# Altium schematic sheet HIVE_BOARD_TOP.SchDoc
size Tabloid; SheetNumber: 3; SheetTotal: 12; Sheet_Name: Top; Size: 11x17
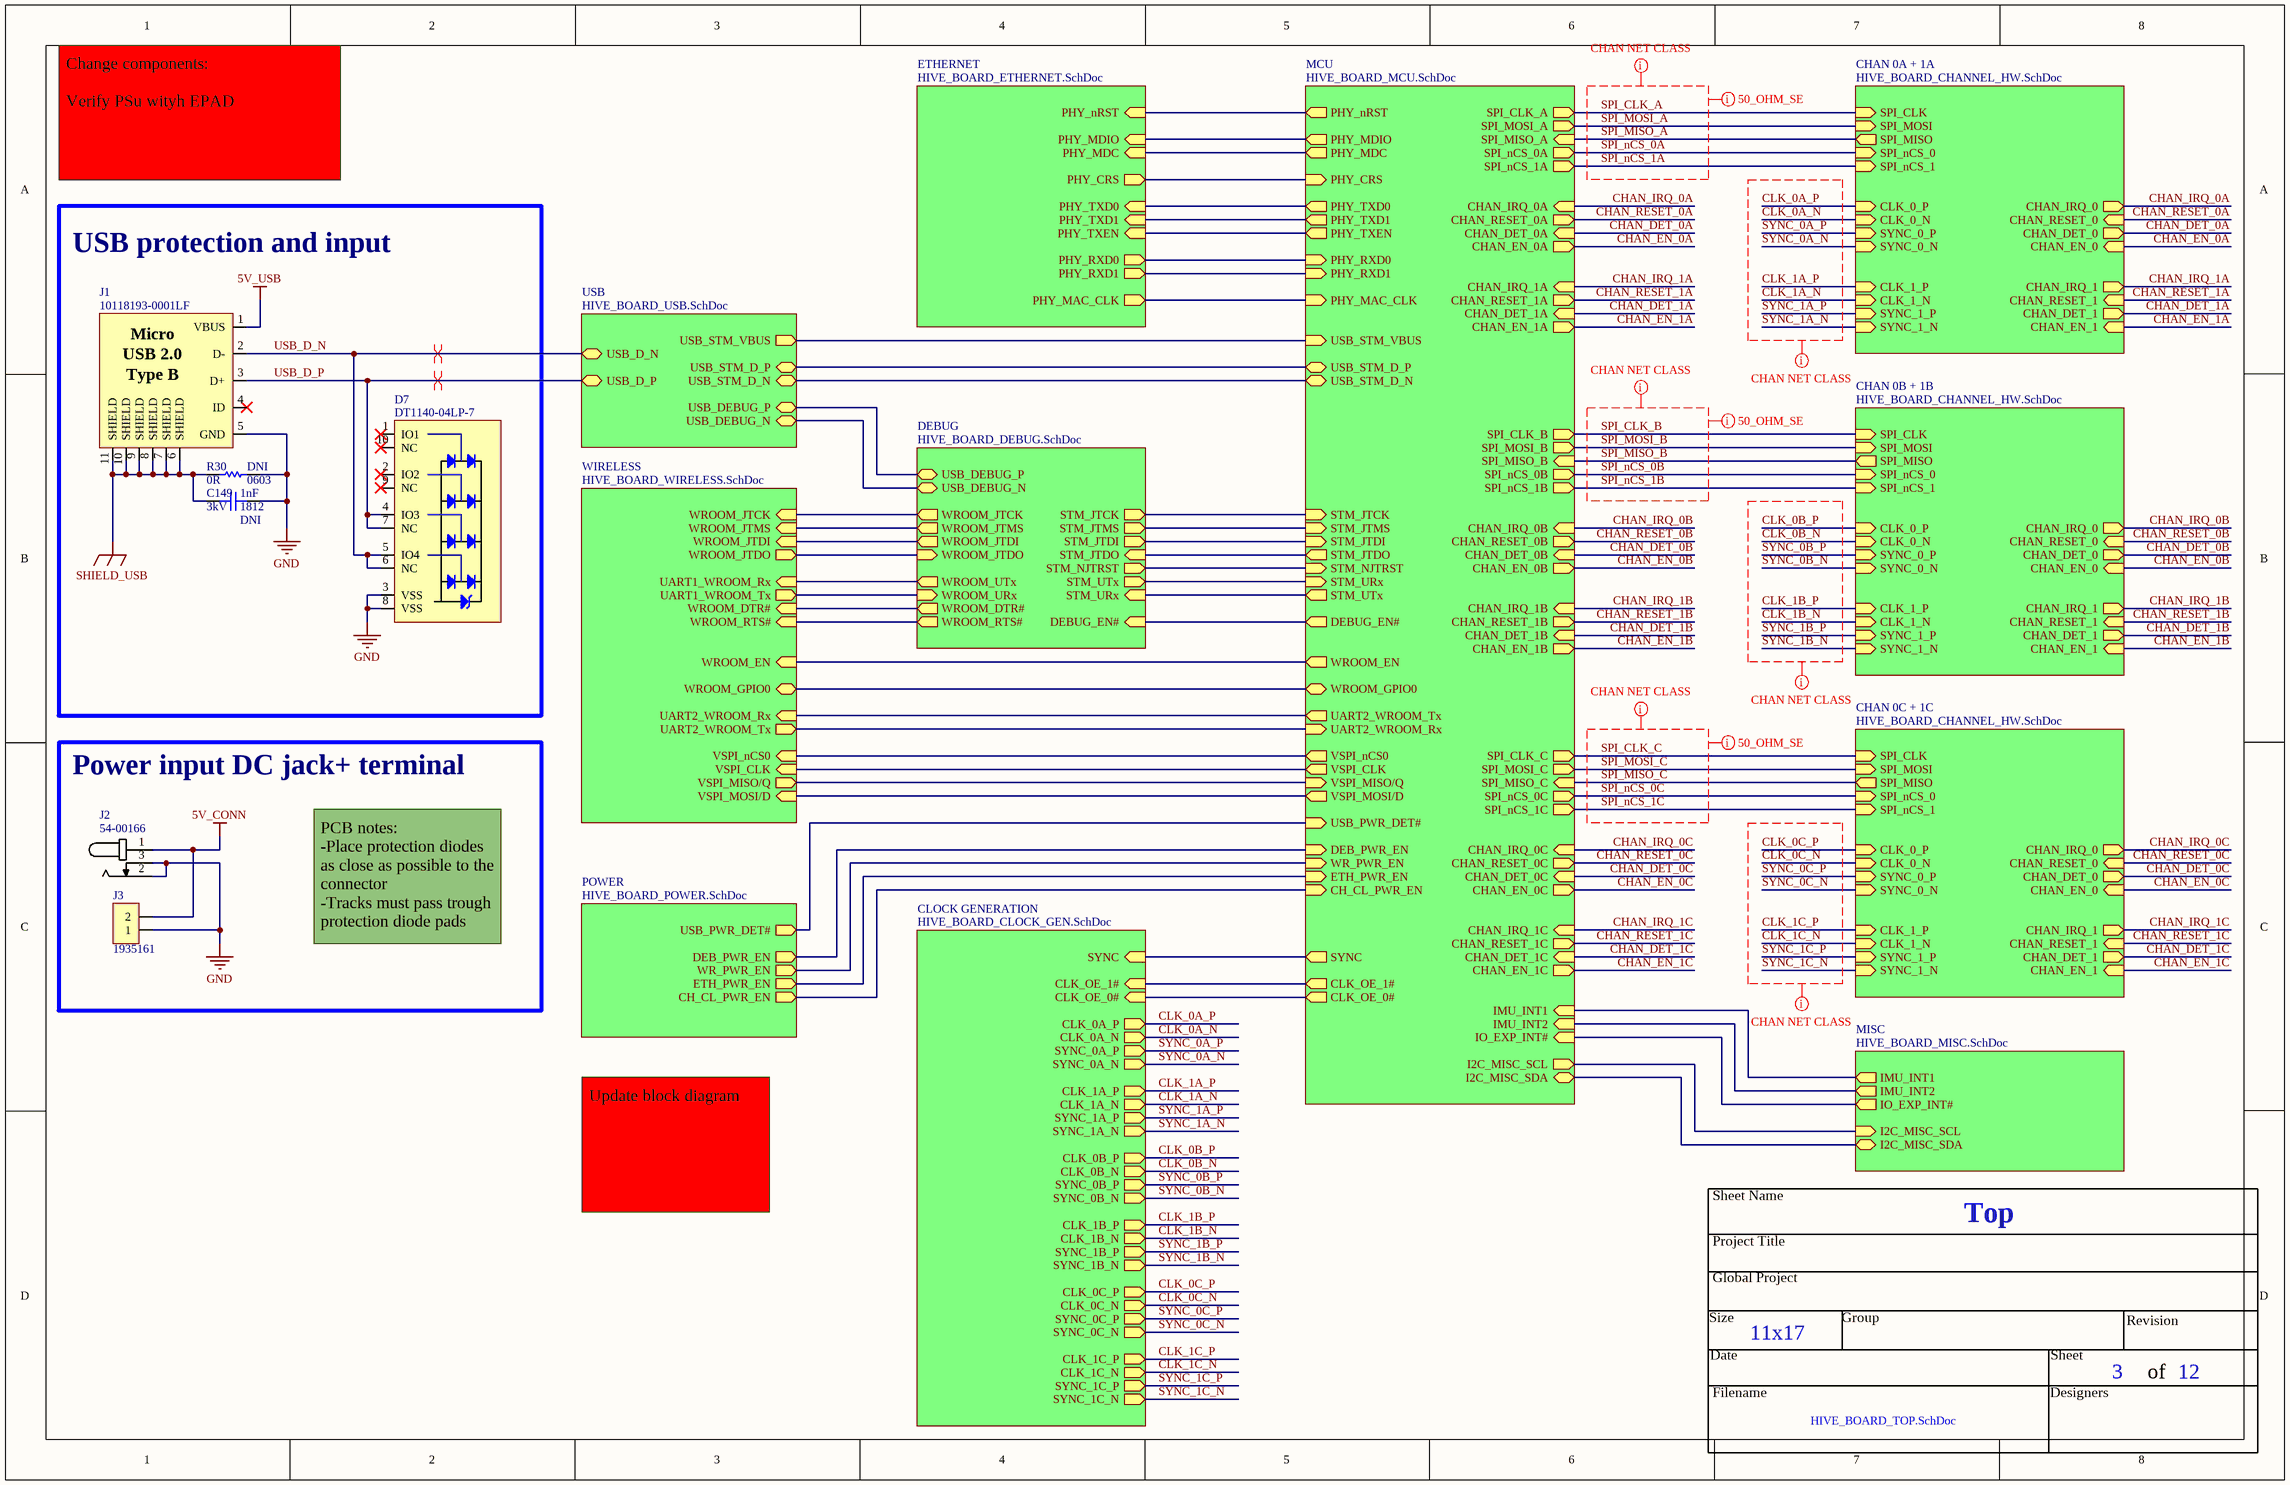
[diagram p0: HIVE_BOARD_TOP.SchDoc]

## Parts
C149  value 1nF  Package: 1812  Voltage Rating: 3kV  Assembly Note: DNI  [CAP_CER_1812]  (hidden comment: 885342211009)
D7  DT1140-04LP-7  [TVS_DATA_DT1140-04LP-7]
J1  10118193-0001LF  [CON_USB_10118194-0001LF]
J2  54-00166  [CON_PWR_PJ-002A]
J3  1935161  [CON_ 1935161]
R30  value 0R  Assembly Note: DNI  Package: 0603  [RES_0603]  (hidden comment: RC0603JR-070RL)

## Blocks framed on the sheet
USB protection and input: C149 D7 J1 R30
Power input DC jack+ terminal: J2 J3

## Sub-sheets
CHAN 0A + 1A = HIVE_BOARD_CHANNEL_HW.SchDoc: SPI_MISO (out), SPI_MOSI (in), SPI_CLK (in), SPI_nCS_1 (in), SPI_nCS_0 (in), SYNC_1_P (in), CLK_1_N (in), SYNC_1_N (in), CLK_1_P (in), SYNC_0_P (in), CLK_0_P (in), CLK_0_N (in), SYNC_0_N (in), CHAN_EN_0 (in), CHAN_DET_0 (out), CHAN_IRQ_0 (out), CHAN_RESET_0 (in), CHAN_EN_1 (in), CHAN_IRQ_1 (out), CHAN_RESET_1 (in), CHAN_DET_1 (out)
CHAN 0B + 1B = HIVE_BOARD_CHANNEL_HW.SchDoc: SPI_MISO (out), SPI_MOSI (in), SPI_CLK (in), SPI_nCS_1 (in), SPI_nCS_0 (in), SYNC_1_P (in), CLK_1_N (in), SYNC_1_N (in), CLK_1_P (in), SYNC_0_P (in), CLK_0_P (in), CLK_0_N (in), SYNC_0_N (in), CHAN_EN_0 (in), CHAN_DET_0 (out), CHAN_IRQ_0 (out), CHAN_RESET_0 (in), CHAN_EN_1 (in), CHAN_IRQ_1 (out), CHAN_RESET_1 (in), CHAN_DET_1 (out)
CHAN 0C + 1C = HIVE_BOARD_CHANNEL_HW.SchDoc: SPI_MISO (out), SPI_MOSI (in), SPI_CLK (in), SPI_nCS_1 (in), SPI_nCS_0 (in), SYNC_1_P (in), CLK_1_N (in), SYNC_1_N (in), CLK_1_P (in), SYNC_0_P (in), CLK_0_P (in), CLK_0_N (in), SYNC_0_N (in), CHAN_EN_0 (in), CHAN_DET_0 (out), CHAN_IRQ_0 (out), CHAN_RESET_0 (in), CHAN_EN_1 (in), CHAN_IRQ_1 (out), CHAN_RESET_1 (in), CHAN_DET_1 (out)
CLOCK GENERATION = HIVE_BOARD_CLOCK_GEN.SchDoc: SYNC (in), SYNC_0B_P (out), SYNC_0A_N (out), SYNC_1C_N (out), SYNC_1B_N (out), SYNC_1C_P (out), CLK_1B_P (out), CLK_0C_P (out), SYNC_0C_N (out), CLK_1A_N (out), CLK_1B_N (out), CLK_1A_P (out), SYNC_1A_N (out), CLK_0B_P (out), SYNC_1B_P (out), SYNC_0C_P (out), CLK_0B_N (out), CLK_1C_N (out), SYNC_0B_N (out), CLK_1C_P (out), SYNC_1A_P (out), CLK_0C_N (out), SYNC_0A_P (out), CLK_0A_P (out), CLK_0A_N (out), CLK_OE_1# (in), CLK_OE_0# (in)
DEBUG = HIVE_BOARD_DEBUG.SchDoc: WROOM_JTCK (out), WROOM_JTDO (in), WROOM_UTx (out), WROOM_JTMS (out), WROOM_URx (in), WROOM_JTDI (out), WROOM_RTS# (out), WROOM_DTR# (out), STM_URx (in), STM_JTDI (out), STM_JTCK (out), STM_JTDO (in), STM_JTMS (out), STM_UTx (out), STM_NJTRST (out), USB_DEBUG_P (bidir), USB_DEBUG_N (bidir), DEBUG_EN# (in)
ETHERNET = HIVE_BOARD_ETHERNET.SchDoc: PHY_nRST (in), PHY_CRS (out), PHY_RXD0 (out), PHY_TXD1 (in), PHY_RXD1 (out), PHY_MDC (in), PHY_MDIO (in), PHY_TXEN (in), PHY_TXD0 (in), PHY_MAC_CLK (out)
MCU = HIVE_BOARD_MCU.SchDoc: SYNC (out), SPI_nCS_1A (out), SPI_MOSI_A (out), SPI_nCS_0A (out), SPI_CLK_A (out), SPI_MISO_A (in), USB_PWR_DET# (in), CHAN_EN_0A (out), CHAN_DET_0A (in), CHAN_IRQ_0A (in), CHAN_RESET_0A (out), CHAN_EN_1A (out), CHAN_IRQ_1A (in), CHAN_RESET_1A (out), CHAN_DET_1A (in), SPI_MOSI_B (out), SPI_CLK_B (out), SPI_MISO_B (in), SPI_nCS_0B (out), SPI_nCS_1B (out), SPI_MOSI_C (out), SPI_CLK_C (out), SPI_MISO_C (in), SPI_nCS_1C (out), SPI_nCS_0C (out), CHAN_DET_0C (in), CHAN_IRQ_0C (in), CHAN_EN_0C (out), CHAN_RESET_0C (out), CHAN_IRQ_1C (in), CHAN_RESET_1C (out), CHAN_EN_1C (out), CHAN_DET_1C (in), CHAN_DET_1B (in), CHAN_EN_1B (out), CHAN_RESET_1B (out), CHAN_IRQ_1B (in), CHAN_IRQ_0B (in), CHAN_EN_0B (out), CHAN_RESET_0B (out), CHAN_DET_0B (in), IMU_INT2 (in), PHY_RXD1 (in), PHY_TXD0 (out), PHY_nRST (out), PHY_MAC_CLK (in), PHY_MDIO (out), PHY_TXD1 (out), PHY_TXEN (out), PHY_MDC (out), PHY_RXD0 (in), PHY_CRS (in), CLK_OE_1# (out), CLK_OE_0# (out), USB_STM_VBUS (in), USB_STM_D_P (bidir), USB_STM_D_N (bidir), WROOM_EN (out), WROOM_GPIO0 (bidir), UART2_WROOM_Tx (out), UART2_WROOM_Rx (in), VSPI_nCS0 (out), VSPI_CLK (out), VSPI_MISO/Q (in), VSPI_MOSI/D (out), STM_UTx (out), STM_URx (in), STM_JTDO (out), STM_JTCK (in), STM_NJTRST (in), STM_JTDI (in), STM_JTMS (in), DEBUG_EN# (out), CH_CL_PWR_EN (in), ETH_PWR_EN (in), WR_PWR_EN (in), DEB_PWR_EN (in), IO_EXP_INT# (in), I2C_MISC_SCL (out), I2C_MISC_SDA (bidir), IMU_INT1 (in)
MISC = HIVE_BOARD_MISC.SchDoc: IMU_INT2 (out), I2C_MISC_SCL (in), I2C_MISC_SDA (bidir), IO_EXP_INT# (out), IMU_INT1 (out)
POWER = HIVE_BOARD_POWER.SchDoc: USB_PWR_DET# (out), WR_PWR_EN (out), CH_CL_PWR_EN (out), ETH_PWR_EN (out), DEB_PWR_EN (out)
USB = HIVE_BOARD_USB.SchDoc: USB_DEBUG_P (bidir), USB_DEBUG_N (bidir), USB_D_N (bidir), USB_D_P (bidir), USB_STM_D_N (bidir), USB_STM_D_P (bidir), USB_STM_VBUS (out)
WIRELESS = HIVE_BOARD_WIRELESS.SchDoc: WROOM_JTDI (in), WROOM_JTCK (in), WROOM_JTMS (in), WROOM_JTDO (out), WROOM_RTS# (in), WROOM_DTR# (in), UART1_WROOM_Rx (in), UART1_WROOM_Tx (out), VSPI_CLK (in), WROOM_EN (in), VSPI_nCS0 (in), UART2_WROOM_Rx (in), UART2_WROOM_Tx (out), WROOM_GPIO0 (bidir), VSPI_MISO/Q (out), VSPI_MOSI/D (in)

## Nets
5V_CONN: J2.1 J3.2
5V_USB: J1.1(VBUS)
GND: C149.1 D7.3(VSS) D7.8(VSS) J1.5(GND) J2.2 J2.3 J3.1 R30.1
SHIELD_USB: C149.2 J1.6(SHIELD) J1.7(SHIELD) J1.8(SHIELD) J1.9(SHIELD) J1.10(SHIELD) J1.11(SHIELD) R30.2
CHAN_DET_0A: sheet MCU/CHAN_DET_0A, sheet CHAN 0A + 1A/CHAN_DET_0
CHAN_DET_0B: sheet MCU/CHAN_DET_0B, sheet CHAN 0B + 1B/CHAN_DET_0
CHAN_DET_0C: sheet MCU/CHAN_DET_0C, sheet CHAN 0C + 1C/CHAN_DET_0
CHAN_DET_1A: sheet MCU/CHAN_DET_1A, sheet CHAN 0A + 1A/CHAN_DET_1
CHAN_DET_1B: sheet MCU/CHAN_DET_1B, sheet CHAN 0B + 1B/CHAN_DET_1
CHAN_DET_1C: sheet MCU/CHAN_DET_1C, sheet CHAN 0C + 1C/CHAN_DET_1
CHAN_EN_0A: sheet MCU/CHAN_EN_0A, sheet CHAN 0A + 1A/CHAN_EN_0
CHAN_EN_0B: sheet MCU/CHAN_EN_0B, sheet CHAN 0B + 1B/CHAN_EN_0
CHAN_EN_0C: sheet MCU/CHAN_EN_0C, sheet CHAN 0C + 1C/CHAN_EN_0
CHAN_EN_1A: sheet MCU/CHAN_EN_1A, sheet CHAN 0A + 1A/CHAN_EN_1
CHAN_EN_1B: sheet MCU/CHAN_EN_1B, sheet CHAN 0B + 1B/CHAN_EN_1
CHAN_EN_1C: sheet MCU/CHAN_EN_1C, sheet CHAN 0C + 1C/CHAN_EN_1
CHAN_IRQ_0A: sheet MCU/CHAN_IRQ_0A, sheet CHAN 0A + 1A/CHAN_IRQ_0
CHAN_IRQ_0B: sheet MCU/CHAN_IRQ_0B, sheet CHAN 0B + 1B/CHAN_IRQ_0
CHAN_IRQ_0C: sheet MCU/CHAN_IRQ_0C, sheet CHAN 0C + 1C/CHAN_IRQ_0
CHAN_IRQ_1A: sheet MCU/CHAN_IRQ_1A, sheet CHAN 0A + 1A/CHAN_IRQ_1
CHAN_IRQ_1B: sheet MCU/CHAN_IRQ_1B, sheet CHAN 0B + 1B/CHAN_IRQ_1
CHAN_IRQ_1C: sheet MCU/CHAN_IRQ_1C, sheet CHAN 0C + 1C/CHAN_IRQ_1
CHAN_RESET_0A: sheet MCU/CHAN_RESET_0A, sheet CHAN 0A + 1A/CHAN_RESET_0
CHAN_RESET_0B: sheet MCU/CHAN_RESET_0B, sheet CHAN 0B + 1B/CHAN_RESET_0
CHAN_RESET_0C: sheet MCU/CHAN_RESET_0C, sheet CHAN 0C + 1C/CHAN_RESET_0
CHAN_RESET_1A: sheet MCU/CHAN_RESET_1A, sheet CHAN 0A + 1A/CHAN_RESET_1
CHAN_RESET_1B: sheet MCU/CHAN_RESET_1B, sheet CHAN 0B + 1B/CHAN_RESET_1
CHAN_RESET_1C: sheet MCU/CHAN_RESET_1C, sheet CHAN 0C + 1C/CHAN_RESET_1
CLK_0A_N: sheet CLOCK GENERATION/CLK_0A_N, sheet CHAN 0A + 1A/CLK_0_N
CLK_0A_P: sheet CLOCK GENERATION/CLK_0A_P, sheet CHAN 0A + 1A/CLK_0_P
CLK_0B_N: sheet CLOCK GENERATION/CLK_0B_N, sheet CHAN 0B + 1B/CLK_0_N
CLK_0B_P: sheet CLOCK GENERATION/CLK_0B_P, sheet CHAN 0B + 1B/CLK_0_P
CLK_0C_N: sheet CLOCK GENERATION/CLK_0C_N, sheet CHAN 0C + 1C/CLK_0_N
CLK_0C_P: sheet CLOCK GENERATION/CLK_0C_P, sheet CHAN 0C + 1C/CLK_0_P
CLK_1A_N: sheet CLOCK GENERATION/CLK_1A_N, sheet CHAN 0A + 1A/CLK_1_N
CLK_1A_P: sheet CLOCK GENERATION/CLK_1A_P, sheet CHAN 0A + 1A/CLK_1_P
CLK_1B_N: sheet CLOCK GENERATION/CLK_1B_N, sheet CHAN 0B + 1B/CLK_1_N
CLK_1B_P: sheet CLOCK GENERATION/CLK_1B_P, sheet CHAN 0B + 1B/CLK_1_P
CLK_1C_N: sheet CLOCK GENERATION/CLK_1C_N, sheet CHAN 0C + 1C/CLK_1_N
CLK_1C_P: sheet CLOCK GENERATION/CLK_1C_P, sheet CHAN 0C + 1C/CLK_1_P
SPI_CLK_A: sheet MCU/SPI_CLK_A, sheet CHAN 0A + 1A/SPI_CLK
SPI_CLK_B: sheet MCU/SPI_CLK_B, sheet CHAN 0B + 1B/SPI_CLK
SPI_CLK_C: sheet MCU/SPI_CLK_C, sheet CHAN 0C + 1C/SPI_CLK
SPI_MISO_A: sheet MCU/SPI_MISO_A, sheet CHAN 0A + 1A/SPI_MISO
SPI_MISO_B: sheet MCU/SPI_MISO_B, sheet CHAN 0B + 1B/SPI_MISO
SPI_MISO_C: sheet MCU/SPI_MISO_C, sheet CHAN 0C + 1C/SPI_MISO
SPI_MOSI_A: sheet MCU/SPI_MOSI_A, sheet CHAN 0A + 1A/SPI_MOSI
SPI_MOSI_B: sheet MCU/SPI_MOSI_B, sheet CHAN 0B + 1B/SPI_MOSI
SPI_MOSI_C: sheet MCU/SPI_MOSI_C, sheet CHAN 0C + 1C/SPI_MOSI
SPI_nCS_0A: sheet MCU/SPI_nCS_0A, sheet CHAN 0A + 1A/SPI_nCS_0
SPI_nCS_0B: sheet MCU/SPI_nCS_0B, sheet CHAN 0B + 1B/SPI_nCS_0
SPI_nCS_0C: sheet MCU/SPI_nCS_0C, sheet CHAN 0C + 1C/SPI_nCS_0
SPI_nCS_1A: sheet MCU/SPI_nCS_1A, sheet CHAN 0A + 1A/SPI_nCS_1
SPI_nCS_1B: sheet MCU/SPI_nCS_1B, sheet CHAN 0B + 1B/SPI_nCS_1
SPI_nCS_1C: sheet MCU/SPI_nCS_1C, sheet CHAN 0C + 1C/SPI_nCS_1
SYNC_0A_N: sheet CLOCK GENERATION/SYNC_0A_N, sheet CHAN 0A + 1A/SYNC_0_N
SYNC_0A_P: sheet CLOCK GENERATION/SYNC_0A_P, sheet CHAN 0A + 1A/SYNC_0_P
SYNC_0B_N: sheet CLOCK GENERATION/SYNC_0B_N, sheet CHAN 0B + 1B/SYNC_0_N
SYNC_0B_P: sheet CLOCK GENERATION/SYNC_0B_P, sheet CHAN 0B + 1B/SYNC_0_P
SYNC_0C_N: sheet CLOCK GENERATION/SYNC_0C_N, sheet CHAN 0C + 1C/SYNC_0_N
SYNC_0C_P: sheet CLOCK GENERATION/SYNC_0C_P, sheet CHAN 0C + 1C/SYNC_0_P
SYNC_1A_N: sheet CLOCK GENERATION/SYNC_1A_N, sheet CHAN 0A + 1A/SYNC_1_N
SYNC_1A_P: sheet CLOCK GENERATION/SYNC_1A_P, sheet CHAN 0A + 1A/SYNC_1_P
SYNC_1B_N: sheet CLOCK GENERATION/SYNC_1B_N, sheet CHAN 0B + 1B/SYNC_1_N
SYNC_1B_P: sheet CLOCK GENERATION/SYNC_1B_P, sheet CHAN 0B + 1B/SYNC_1_P
SYNC_1C_N: sheet CLOCK GENERATION/SYNC_1C_N, sheet CHAN 0C + 1C/SYNC_1_N
SYNC_1C_P: sheet CLOCK GENERATION/SYNC_1C_P, sheet CHAN 0C + 1C/SYNC_1_P
USB_D_N: D7.5(IO4) D7.6(NC) J1.2(D-) ; sheet USB/USB_D_N
USB_D_P: D7.4(IO3) D7.7(NC) J1.3(D+) ; sheet USB/USB_D_P
(unnamed): sheet MCU/SYNC, sheet CLOCK GENERATION/SYNC
(unnamed): sheet MCU/USB_PWR_DET#, sheet POWER/USB_PWR_DET#
(unnamed): sheet MCU/IMU_INT2, sheet MISC/IMU_INT2
(unnamed): sheet MCU/PHY_RXD1, sheet ETHERNET/PHY_RXD1
(unnamed): sheet MCU/PHY_TXD0, sheet ETHERNET/PHY_TXD0
(unnamed): sheet MCU/PHY_nRST, sheet ETHERNET/PHY_nRST
(unnamed): sheet MCU/PHY_MAC_CLK, sheet ETHERNET/PHY_MAC_CLK
(unnamed): sheet MCU/PHY_MDIO, sheet ETHERNET/PHY_MDIO
(unnamed): sheet MCU/PHY_TXD1, sheet ETHERNET/PHY_TXD1
(unnamed): sheet MCU/PHY_TXEN, sheet ETHERNET/PHY_TXEN
(unnamed): sheet MCU/PHY_MDC, sheet ETHERNET/PHY_MDC
(unnamed): sheet MCU/PHY_RXD0, sheet ETHERNET/PHY_RXD0
(unnamed): sheet MCU/PHY_CRS, sheet ETHERNET/PHY_CRS
(unnamed): sheet MCU/CLK_OE_1#, sheet CLOCK GENERATION/CLK_OE_1#
(unnamed): sheet MCU/CLK_OE_0#, sheet CLOCK GENERATION/CLK_OE_0#
(unnamed): sheet MCU/USB_STM_VBUS, sheet USB/USB_STM_VBUS
(unnamed): sheet MCU/USB_STM_D_P, sheet USB/USB_STM_D_P
(unnamed): sheet MCU/USB_STM_D_N, sheet USB/USB_STM_D_N
(unnamed): sheet MCU/WROOM_EN, sheet WIRELESS/WROOM_EN
(unnamed): sheet MCU/WROOM_GPIO0, sheet WIRELESS/WROOM_GPIO0
(unnamed): sheet MCU/UART2_WROOM_Tx, sheet WIRELESS/UART2_WROOM_Rx
(unnamed): sheet MCU/UART2_WROOM_Rx, sheet WIRELESS/UART2_WROOM_Tx
(unnamed): sheet MCU/VSPI_nCS0, sheet WIRELESS/VSPI_nCS0
(unnamed): sheet MCU/VSPI_CLK, sheet WIRELESS/VSPI_CLK
(unnamed): sheet MCU/VSPI_MISO/Q, sheet WIRELESS/VSPI_MISO/Q
(unnamed): sheet MCU/VSPI_MOSI/D, sheet WIRELESS/VSPI_MOSI/D
(unnamed): sheet MCU/STM_UTx, sheet DEBUG/STM_URx
(unnamed): sheet MCU/STM_URx, sheet DEBUG/STM_UTx
(unnamed): sheet MCU/STM_JTDO, sheet DEBUG/STM_JTDO
(unnamed): sheet MCU/STM_JTCK, sheet DEBUG/STM_JTCK
(unnamed): sheet MCU/STM_NJTRST, sheet DEBUG/STM_NJTRST
(unnamed): sheet MCU/STM_JTDI, sheet DEBUG/STM_JTDI
(unnamed): sheet MCU/STM_JTMS, sheet DEBUG/STM_JTMS
(unnamed): sheet MCU/DEBUG_EN#, sheet DEBUG/DEBUG_EN#
(unnamed): sheet MCU/CH_CL_PWR_EN, sheet POWER/CH_CL_PWR_EN
(unnamed): sheet MCU/ETH_PWR_EN, sheet POWER/ETH_PWR_EN
(unnamed): sheet MCU/WR_PWR_EN, sheet POWER/WR_PWR_EN
(unnamed): sheet MCU/DEB_PWR_EN, sheet POWER/DEB_PWR_EN
(unnamed): sheet MCU/IO_EXP_INT#, sheet MISC/IO_EXP_INT#
(unnamed): sheet MCU/I2C_MISC_SCL, sheet MISC/I2C_MISC_SCL
(unnamed): sheet MCU/I2C_MISC_SDA, sheet MISC/I2C_MISC_SDA
(unnamed): sheet MCU/IMU_INT1, sheet MISC/IMU_INT1
(unnamed): sheet WIRELESS/WROOM_JTDI, sheet DEBUG/WROOM_JTDI
(unnamed): sheet WIRELESS/WROOM_JTCK, sheet DEBUG/WROOM_JTCK
(unnamed): sheet WIRELESS/WROOM_JTMS, sheet DEBUG/WROOM_JTMS
(unnamed): sheet WIRELESS/WROOM_JTDO, sheet DEBUG/WROOM_JTDO
(unnamed): sheet WIRELESS/WROOM_RTS#, sheet DEBUG/WROOM_RTS#
(unnamed): sheet WIRELESS/WROOM_DTR#, sheet DEBUG/WROOM_DTR#
(unnamed): sheet WIRELESS/UART1_WROOM_Rx, sheet DEBUG/WROOM_UTx
(unnamed): sheet WIRELESS/UART1_WROOM_Tx, sheet DEBUG/WROOM_URx
(unnamed): sheet USB/USB_DEBUG_P, sheet DEBUG/USB_DEBUG_P
(unnamed): sheet USB/USB_DEBUG_N, sheet DEBUG/USB_DEBUG_N

Not connected (* = marked no-connect by the designer): D7 1(IO1)* 2(IO2)* 9(NC)* 10(NC)*; J1 4(ID)*

## Layout directives
differential pair; differential pair class DIFF_90: USB_D_N, USB_D_P
net class CHAN_A; net class CHAN_SIGNALS: CLK_0A_N, CLK_0A_P, CLK_0B_N, CLK_0B_P, CLK_0C_N, CLK_0C_P, CLK_1A_N, CLK_1A_P, CLK_1B_N, CLK_1B_P, CLK_1C_N, CLK_1C_P, SPI_CLK_A, SPI_CLK_B, SPI_CLK_C, SPI_MISO_A, SPI_MISO_B, SPI_MISO_C, SPI_MOSI_A, SPI_MOSI_B, SPI_MOSI_C, SPI_nCS_0A, SPI_nCS_0B, SPI_nCS_0C, SPI_nCS_1A, SPI_nCS_1B, SPI_nCS_1C, SYNC_0A_N, SYNC_0A_P, SYNC_0B_N, SYNC_0B_P, SYNC_0C_N, SYNC_0C_P, SYNC_1A_N, SYNC_1A_P, SYNC_1B_N, SYNC_1B_P, SYNC_1C_N, SYNC_1C_P
net class SE_50: SPI_CLK_A, SPI_CLK_B, SPI_CLK_C, SPI_MISO_A, SPI_MISO_B, SPI_MISO_C, SPI_MOSI_A, SPI_MOSI_B, SPI_MOSI_C, SPI_nCS_0A, SPI_nCS_0B, SPI_nCS_0C, SPI_nCS_1A, SPI_nCS_1B, SPI_nCS_1C

## Notes on the sheet
- Change components:
  Verify PSu wityh EPAD
- PCB notes:
  -Place protection diodes as close as possible to the connector
  -Tracks must pass trough protection diode pads
- Update block diagram
- Sheet Name
- Project Title
- Global Project
- Revision
- Size
- Date
- Group
- Sheet
- of
- Filename
- Designers
- (in symbol CON_USB_2.0_MicroB_10118193-0001LF) Micro; USB 2.0; Type B

## Library data of the parts
C149 = CAP_CER_885342211009: CAP - CER 1000pF ±10% 3000V X7R; Manufacturer #1: Würth Elektronik; GRAMS Lib Spec: 2.8; Magnetic Material: Unknown; Polarized: No; Tolerance: 10%; Current Rating: *; Power Max: *; HelpURL: https://www.we-online.de/katalog/datasheet/885342211009.pdf; CreatedBy/Date: Hubert Dube - 03/02/2021; VerifiedBy: Philippe Asenault - 08-02-2021; Temperature: -55°C ~ 125°C; Manufacturer #2: *; Note: *; Assembly Type: SMD; Part Number #2: *; Part Number #1: 885342211009; Cryo: UNKNOWN; Supplier 1: Digi-Key; Supplier Part Number 1: 732-12109-1-ND
D7 = TVS_DATA_DT1140-04LP-7: TVS - DIODE 5.5V 10V - 10-UFDFN; Manufacturer #1: Diodes Incorporated; Value: 5.5V @ 1mA (Reverse Standoff); Voltage Rating: 6V (Breakdown); Current Rating: 6A (8/20µs); Power Max: 60W (8/20µs); GRAMS Lib Spec: 2.8; Note: Fooprint created from tpd4e05u06 (TI) for manufacturability (soldermask); Magnetic Material: UNKNOWN; Polarized: Yes; Tolerance: -; HelpURL: https://www.diodes.com/assets/Datasheets/DT1140-04LP.pdf; CreatedBy/Date: Joël Lemay 2019-11-20; VerifiedBy: C.Paulin - 21/11/2019; Temperature: -55°C~85°C; Package: 10-UFDFN; Manufacturer #2: -; Assembly Type: SMD; Part Number #2: -; Part Number #1: DT1140-04LP-7; Supplier 1: Digi-Key; Supplier Part Number 1: DT1140-04LP-7DICT-ND; Cryo: UNKNOWN; Solder Paste Type: UNKNOWN; Stencil Thickness (Recommended): UNKNOWN
J1 = CON_USB_2.0_MicroB_10118193-0001LF: CON - USB MICRO B RECPT SMT R/A - 4PIN; Manufacturer #1: Amphenol ICC (FCI); Value: USB - Micro B; Voltage Rating: 100VAC; Current Rating: 1.8A/contact; GRAMS Lib Spec: 2.8; Magnetic Material: YES; Cryo: UNKNOWN; Tolerance: *; Power Max: *; HelpURL: https://www.amphenol-icc.com/media/wysiwyg/files/drawing/10118193.pdf?__cf_chl_jschl_tk__=6d5b316db0ca5d2788caa1989b39659b9ea3c0ed-1622505795-0-AaRt1DRyGvMNSBAk-qveCbchLKWQVIAmMiw21edGgytfrVBaCdBHD0R7JP7UqzERtsgLGU8HnLnb9NYw-qq_cWljJZMkMwMtVSFHzRWJlLGbudgxgloryBeAgmSCpzkO2dZRjU3EQamWhvcULwajMV3fUiPho2i-h9AvBD-JqRwzr_N72ynCGWIjWcVHfmsFPyxAQrRMF2zITy4XZMyiz2AisoEE3UXmLsQg-7dODwqIJ2w3QedNraoyztkugiCMWxiG_3uBZp4Hnkmn46Uonr3vdxMQME4_KheuMgFPp_P5DOBRGOjNcuKVWDKaTIxtzSjm-Vi4YySbwfngYOahHgBwxZ2C5SyJl7R0K4LSNt2ojAQ_mNseQmjUzt2NlEQzWcUY5VyszMT4_2moKBiyVJV5rMzbQJeY5pbhSVMFh_uqO5OAY_NpBW4J5fNDt7yaBnEN83RzXmHLdXapuDszcAuGnTT7dhkWobY6IAAHQ-dVnvz40dzhWNjP-wfi7Oy6mg; CreatedBy/Date: Louis-Daniel Gaulin / 31-05-2021; VerifiedBy: Philippe Arsenault/2021-06-07; Temperature: -30°C ~ 80°C; Package: 5-SMD; Manufacturer #2: *; Note: *; Assembly Type: SMD; Part Number #2: *; Part Number #1: 10118193-0001LF; Polarized: YES; Supplier 1: Digi-Key; Supplier Part Number 1: 609-4616-1-ND
J2 = CON_PWR_54-00166: CON -  PWR JACK 231X5.5MM SOLDER RIGHT ANGLE - TH; Manufacturer #1: Tensility International Corp; Value: 2.10mm ID (0.083"), 5.50mm OD (0.217"); Voltage Rating: 48V; Current Rating: 6A; GRAMS Lib Spec: 2.8; Magnetic Material: Unknown; Polarized: Yes; Tolerance: -; Power Max: *; HelpURL: https://tensility.s3.amazonaws.com/uploads/pdffiles/54-00166.pdf?X-Amz-Expires=600&X-Amz-Date=20210524T010042Z&X-Amz-Algorithm=AWS4-HMAC-SHA256&X-Amz-Credential=AKIAIS2S4WRDQDSWDRZQ%2F20210524%2Fus-west-2%2Fs3%2Faws4_request&X-Amz-SignedHeaders=host&X-Amz-Signature=421a14a98a6cb1d4ecc5694c8922295a9a1148252ef58783507cb2127da09a73; CreatedBy/Date: L-D Gaulin / 23-05-2021; VerifiedBy: Philippe Arsenault/24-05-2021; Temperature: -20°C ~ 70°C; Package: TH; Manufacturer #2: -; Note: -; Assembly Type: TH; Part Number #2: -; Part Number #1: 54-00166; Supplier 1: Digi-Key; Supplier Part Number 1: 839-54-00166-ND; Cryo: UNKNOWN
J3 = CON_1935161: CON - TERM BLK 2POS SIDE ENTRY 5MM PCB - TH - 14-26 AWG; Manufacturer #1: Phoenix Contact; Current Rating: 17.5A; Magnetic Material: Unknown; Polarized: Yes; Voltage Rating: 400V; GRAMS Lib Spec: 2.8; Assembly Type: TH; Manufacturer #2: *; Note: *; Part Number #1: 1935161; Part Number #2: *; Package: TH; Power Max: *; Value: *; Temperature: -40 °C ~ 100 °C; HelpURL: https://media.digikey.com/pdf/Data%20Sheets/Phoenix%20Contact%20PDFs/1935161.pdf; CreatedBy/Date: Louis-Daniel Gaulin / 02-11-2020; Supplier 1: Digi-Key; Supplier Part Number 1: 277-1667-ND; Tolerance: *; VerifiedBy: Philippe Arsenault/2020-11-06; Cryo: UNKNOWN
R30 = RES_RC0603JR-070RL: RES - 0 ohm jumper 1/10W - 0603; Manufacturer #1: Yageo; GRAMS Lib Spec: 2.8; Magnetic Material: Unknown; Polarized: No; Assembly Type: SMD; CreatedBy/Date: L-P Gauthier 2018-10-30; Current Rating: *; HelpURL: http://www.yageo.com/documents/recent/PYu-RC_Group_51_RoHS_L_9.pdf; Manufacturer #2: *; Part Number #1: RC0603JR-070RL; Part Number #2: *; Power Max: 1/10W; Temperature: -55°C ~ 155°C; VerifiedBy: Caroline Paulin  - 5/11/2018; Voltage Rating: -; Supplier 1: Digi-Key; Supplier Part Number 1: 311-0.0GRCT-ND; Cryo: UNKNOWN